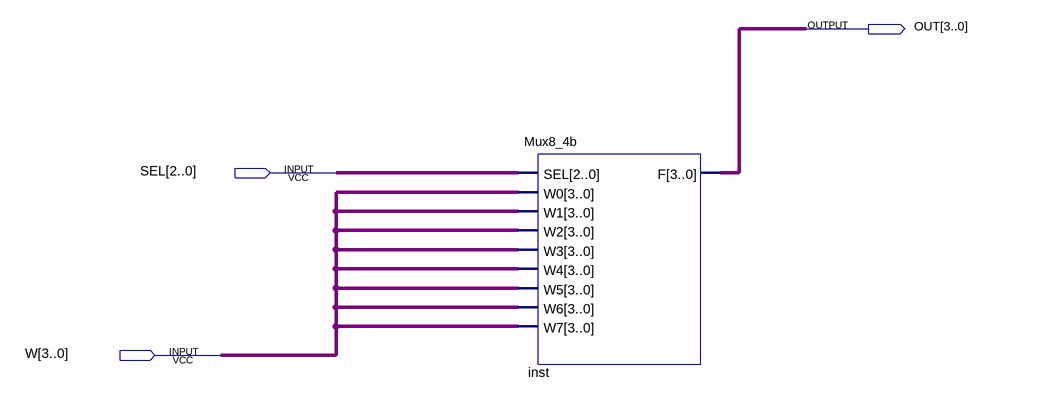
[diagram p0: schematic sheet]
// Quartus schematic Testing.bdf as structural Verilog: 1 symbols, 3 pins
module Testing (
  input  [2:0] SEL,
  input  [3:0] W,
  output [3:0] OUT
);

  Mux8_4b inst (.SEL(SEL), .W0(W), .W1(W), .W2(W), .W3(W), .W4(W), .W5(W), .W6(W), .W7(W), .F(OUT));
endmodule
